# EAGLE design wiTEMP (EAGLE 9.6.1)
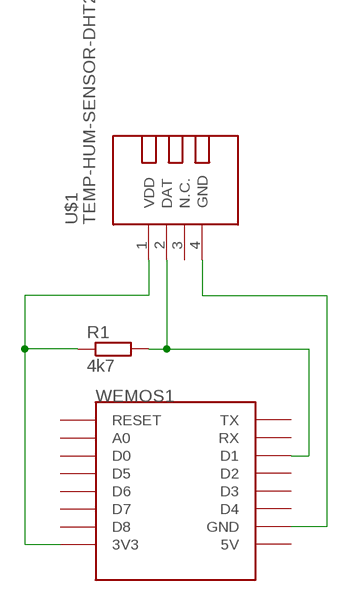
[diagram p0: schematic, sheet 1]

## Parts
R1  4k7  R-EU_0207/10  [0207/10]
U$1  TEMP-HUM-SENSOR-DHT22  [TEMP-HUM-SENSOR-DHT22]
WEMOS1  WEMOS-D1-MINI  [WEMOS-D1-MINI]

## Nets
N$1: R1.1 U$1.1(VDD) WEMOS1.3V3
N$2: U$1.4(GND) WEMOS1.GND
N$3: R1.2 U$1.2(DAT) WEMOS1.D1
Unconnected: U$1.3(N.C.) WEMOS1.5V WEMOS1.A0 WEMOS1.D0 WEMOS1.D2 WEMOS1.D3 WEMOS1.D4 WEMOS1.D5 WEMOS1.D6 WEMOS1.D7 WEMOS1.D8 WEMOS1.RESET WEMOS1.RX WEMOS1.TX

## Library data of the parts
R1 = rcl:R-EU_: RESISTOR, European symbol; SPICEPREFIX: R
U$1 = diy-modules:TEMP-HUM-SENSOR-DHT22: DHT22 - digital humidity & temperature sensor Also known as: AM2302 AM2302 datasheet available here: http://akizukidenshi.com/download/ds/aosong/AM2302.pdf Click here to find device on ebay.com <http://www.ebay.com/sch/dht22+digital+sensor>
WEMOS1 = esp8266modules:WEMOS-D1-MINI: WeMos.cc D1 mini ESP8266 module

## Board
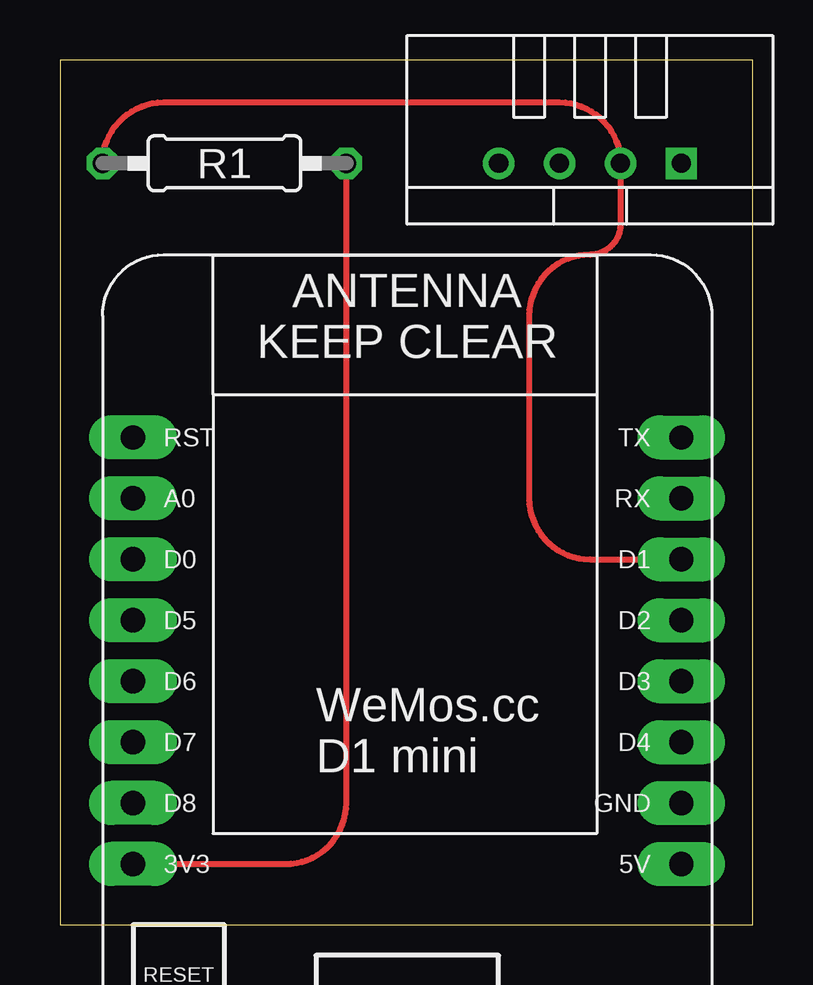
[diagram p1: board, top side]
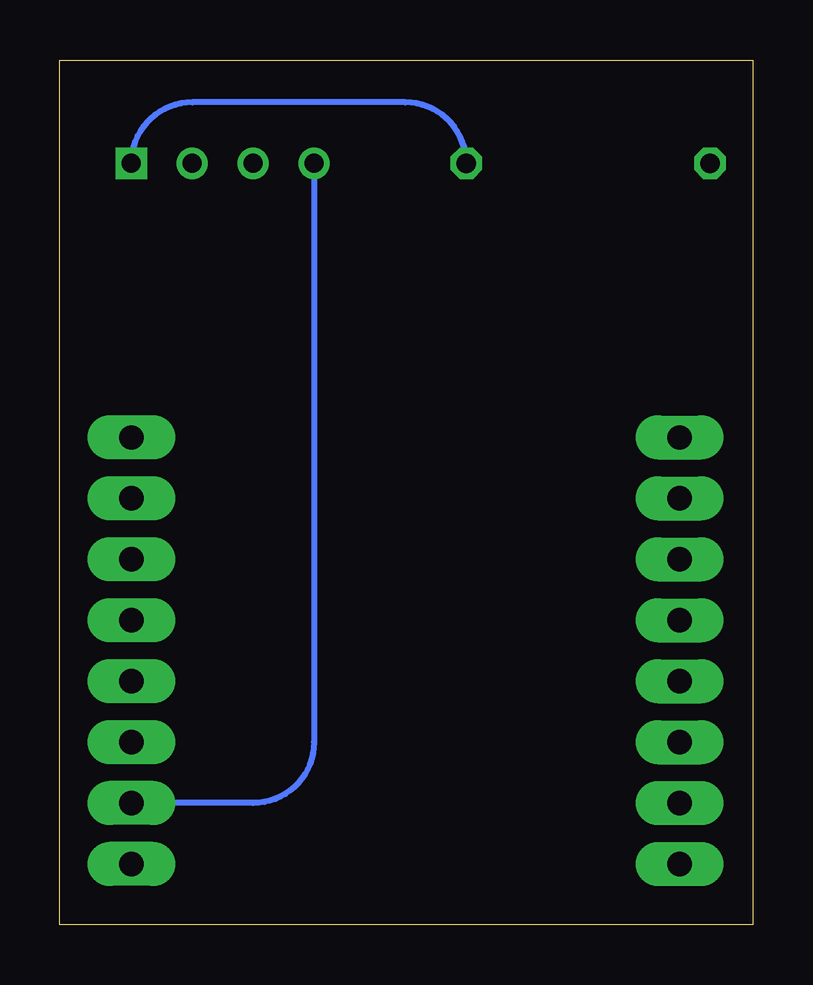
[diagram p2: board, bottom side, seen from below]

Size 28.88 x 36.06 mm. Coordinates in mm from the lower left corner, seen from the top.
Outline: 0,0 28.88,0 28.88,36.06 0,36.06 0,0
Copper layers (1*16): Top 0.035mm / dielectric 1.5mm / Bottom 0.035mm
Design rules "default": minimum track width 6mil, minimum drill 0.35mm, track to track 6mil, track to pad 6mil, pad to pad 6mil, via to via 6mil, smd to smd 6mil, copper to edge 40mil, drill to drill 6mil, minimum pad ring 10mil, minimum via ring 8mil, stop-mask expansion 4mil, vias tented up to drill 0mil, thermal gap 10mil

### Footprints (pad centres in the part's own frame; a part is rotated, then mirrored left to right if it is on the bottom)
0207/10 = drill 0.813 octagon: 1 -5.08,0; 2 5.08,0
TEMP-HUM-SENSOR-DHT22 = drill 0.8 square: 1 -3.81,0 | drill 0.8: 2 -1.27,0; 3 1.27,0; 4 3.81,0
WEMOS-D1-MINI = drill 1.016 pad 1.829 long: 3V3 -10.16,-10.16; 5V 12.7,-10.16; A0 -10.16,5.08; D0 -10.16,2.54; D1 12.7,2.54; D2 12.7,0; D3 12.7,-2.54; D4 12.7,-5.08; D5 -10.16,0; D6 -10.16,-2.54; D7 -10.16,-5.08; D8 -10.16,-7.62; GND 12.7,-7.62; RESET -10.16,7.62; RX 12.7,5.08; TX 12.7,7.62

### Placement (x,y rotation side)
R1  6.86,31.75 180 top
U$1  22.1,31.75 180 top
WEMOS1  13.21,12.7 0 top

### Tracks (layer width: path | path; a pad name or v marks a point on that pad's centre or on a via)
N$1
  Top 0.254: WEMOS1.3V3 9.4,2.54 arc90 11.94,5.08 R1.1
  Bottom 0.254: R1.1 arc-90 14.48,34.29 23.37,34.29 arc-90 U$1.1
N$2
  Bottom 0.254: U$1.4 18.29,7.62 arc90 20.83,5.08 WEMOS1.GND
N$3
  Top 0.254: R1.2 arc-90 4.32,34.29 20.83,34.29 arc-90 U$1.2 23.37,29.21 arc-90 22.1,27.94 arc90 19.56,25.4 19.56,17.78 arc90 22.1,15.24 WEMOS1.D1